# EAGLE schematic driver ckt_3 (EAGLE 8.4.3)
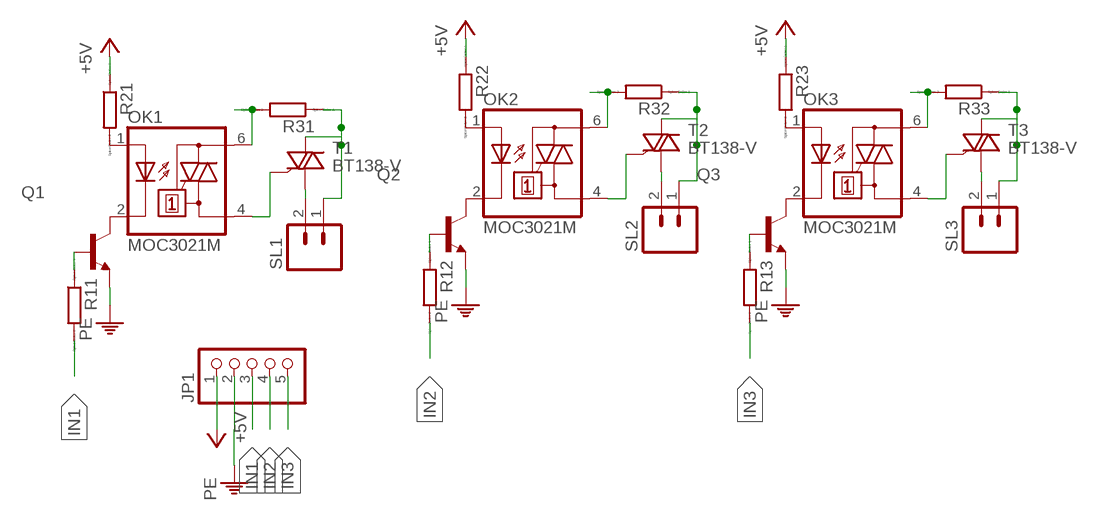
[diagram p0: schematic, sheet 1]

## Parts
JP1  PINHD-1X5  [1X05]
OK1  MOC3021M  [DIL06]
OK2  MOC3021M  [DIL06]
OK3  MOC3021M  [DIL06]
Q1  -NPN-SOT23-EBC  [SOT23-EBC]
Q2  -NPN-SOT23-EBC  [SOT23-EBC]
Q3  -NPN-SOT23-EBC  [SOT23-EBC]
R11  RR1206  [R1206]
R12  RR1206  [R1206]
R13  RR1206  [R1206]
R21  RR1206  [R1206]
R22  RR1206  [R1206]
R23  RR1206  [R1206]
R31  RR1206  [R1206]
R32  RR1206  [R1206]
R33  RR1206  [R1206]
SL1  M02  [02P]
SL2  M02  [02P]
SL3  M02  [02P]
T1  BT138-V  [TO220BV]
T2  BT138-V  [TO220BV]
T3  BT138-V  [TO220BV]

## Nets
+5V: JP1.1 R21.1 R22.1 R23.1
IN1: JP1.3 R11.2
IN2: JP1.4 R12.2
IN3: JP1.5 R13.2
N$1: OK1.6(A2) R31.2
N$2: R31.1 SL1.1 T1.T2(A2)
N$3: SL1.2 T1.T1(A1)
N$4: OK1.1(A) R21.2
N$5: OK1.2(C) Q1.C
N$6: OK2.4(A1) T2.G
N$7: OK1.4(A1) T1.G
N$8: OK2.6(A2) R32.2
N$9: Q1.B R11.1
N$10: R32.1 SL2.1 T2.T2(A2)
N$11: Q2.B R12.1
N$12: SL2.2 T2.T1(A1)
N$13: OK2.1(A) R22.2
N$14: OK2.2(C) Q2.C
N$15: OK3.4(A1) T3.G
N$16: OK3.6(A2) R33.2
N$17: R33.1 SL3.1 T3.T2(A2)
N$18: Q3.B R13.1
N$19: SL3.2 T3.T1(A1)
N$20: OK3.1(A) R23.2
N$21: OK3.2(C) Q3.C
PE: JP1.2 Q1.E Q2.E Q3.E

## Library data of the parts
JP1 = pinhead:PINHD-1X5: PIN HEADER
OK1-OK3 = optocoupler:MOC30*M: RANDOM-PHASE OPTOISOLATORS TRIAC DRIVER OUTPUT Source: http://www.fairchildsemi.com MOC3020-M.pdf; MF: FAIRCHILD SEMICONDUCTOR; MPN: MOC3021-M; OC_FARNELL: 1021365; OC_NEWARK: 95B7895
Q1-Q3 = transistor:*-NPN-: NPN Transistror BF959 corrected 2008.03.06
R11-R13 R21-R23 R31-R33 = eagle-ltspice:R: RESISTOR, European symbol; SPICEMODEL: NONE; SPICEPREFIX: R
SL1-SL3 = con-amp-quick:M02: AMP QUICK CONNECTOR; OC_FARNELL: unknown; OC_NEWARK: unknown
T1-T3 = triac:BT138: TRIAC Source: http://www.semiconductors.philips.com BT138_SERIES_2.pdf